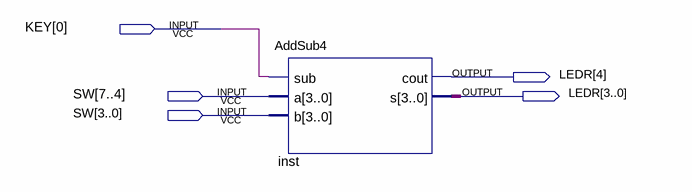
[diagram p0: schematic sheet]
// Quartus schematic AdderDemo.bdf as structural Verilog: 1 symbols, 5 pins
module AdderDemo (
  input  [0:0] KEY,
  input  [7:0] SW,
  output [4:0] LEDR
);

  AddSub4 inst (.sub(KEY[0]), .a(SW[7:4]), .b(SW[3:0]), .cout(LEDR[4]), .s(LEDR[3:0]));
endmodule
